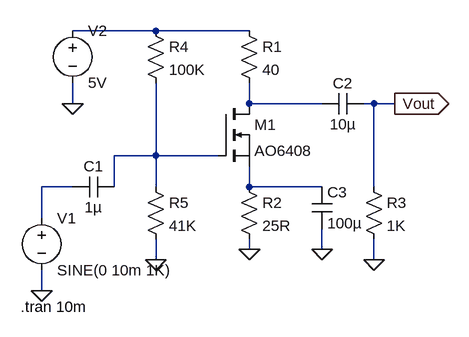
[diagram p0: schematic NNM24EE022_AnwithaBhat.asc]
NNM24EE022_AnwithaBhat.asc, the LTspice schematic file:
Version 4.1
SHEET 1 880 680
WIRE 64 16 -64 16
WIRE 208 16 64 16
WIRE -64 128 -64 96
WIRE 208 128 208 96
WIRE 320 128 208 128
WIRE 400 128 384 128
WIRE 432 128 400 128
WIRE 64 208 64 96
WIRE 64 208 0 208
WIRE 160 208 64 208
WIRE -64 256 -112 256
WIRE 0 256 0 208
WIRE 64 256 64 208
WIRE 208 256 208 224
WIRE 320 256 208 256
WIRE 400 256 400 128
WIRE -112 304 -112 256
WIRE 208 352 208 336
WIRE 320 352 320 320
WIRE 64 368 64 336
WIRE 400 368 400 336
WIRE -112 416 -112 384
FLAG 432 128 Vout
IOPIN 432 128 Out
FLAG -64 128 0
FLAG -112 416 0
FLAG 64 368 0
FLAG 208 352 0
FLAG 320 352 0
FLAG 400 368 0
SYMBOL nmos 160 128 R0
SYMATTR InstName M1
SYMATTR Value AO6408
SYMBOL res 192 0 R0
SYMATTR InstName R1
SYMATTR Value 40
SYMBOL res 192 240 R0
SYMATTR InstName R2
SYMATTR Value 25R
SYMBOL res 384 240 R0
SYMATTR InstName R3
SYMATTR Value 1K
SYMBOL res 48 0 R0
SYMATTR InstName R4
SYMATTR Value 100K
SYMBOL res 48 240 R0
SYMATTR InstName R5
SYMATTR Value 41K
SYMBOL cap 0 240 R90
WINDOW 0 0 32 VBottom 2
WINDOW 3 32 32 VTop 2
SYMATTR InstName C1
SYMATTR Value 1µ
SYMBOL cap 384 112 R90
WINDOW 0 0 32 VBottom 2
WINDOW 3 32 32 VTop 2
SYMATTR InstName C2
SYMATTR Value 10µ
SYMBOL cap 304 256 R0
SYMATTR InstName C3
SYMATTR Value 100µ
SYMBOL voltage -112 288 R0
WINDOW 123 0 0 Left 0
WINDOW 39 0 0 Left 0
SYMATTR InstName V1
SYMATTR Value SINE(0 10m 1K)
SYMBOL voltage -64 0 R0
SYMATTR InstName V2
SYMATTR Value 5V
TEXT -144 440 Left 2 !.tran 10m

The netlist it stands for:
* NNM24EE022_AnwithaBhat.asc
M1 N002 N003 N005 N005 AO6408
R1 N001 N002 40
R2 N005 0 25R
R3 Vout 0 1K
R4 N001 N003 100K
R5 N003 0 41K
C1 N003 N004 1µ
C2 Vout N002 10µ
C3 N005 0 100µ
V1 N004 0 SINE(0 10m 1K)
V2 N001 0 5V
.model NMOS NMOS
.model PMOS PMOS
.lib standard.mos
.tran 10m
.backanno
.end